# EAGLE design PANEL (EAGLE 7.5.0)
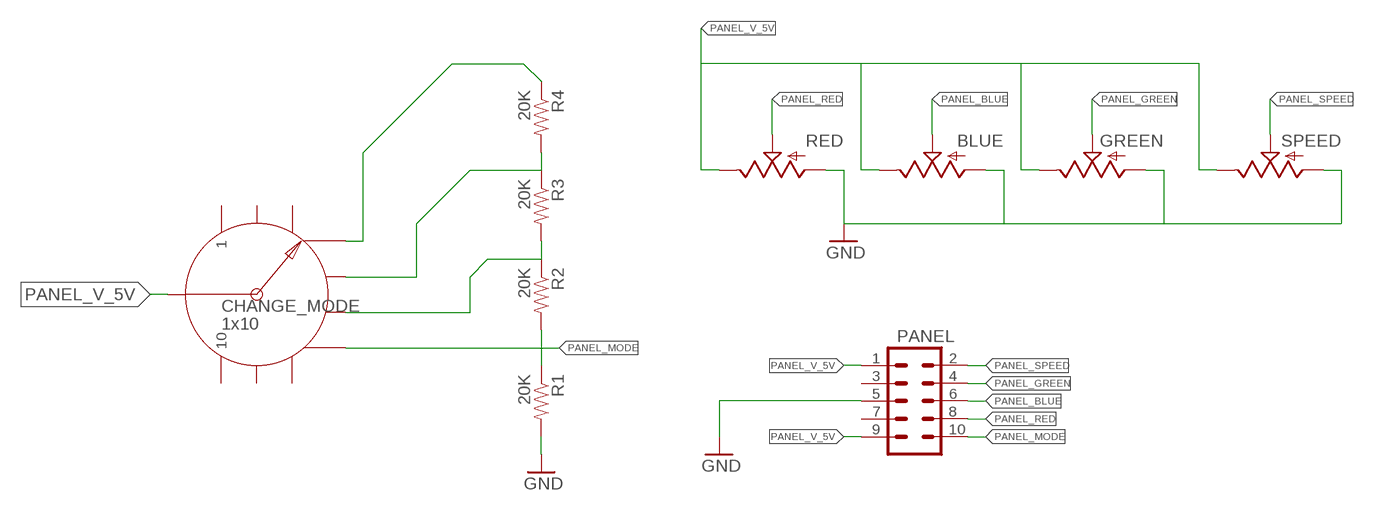
[diagram p0: schematic, sheet 1]

## Parts
BLUE  POT-RV16AF-20  [POT_ALPHA_RV16AF-20]
CHANGE_MODE  1x10  SWITCH_ROTARY_1X10  [ROTARY_SWITCH_1X10]
GREEN  POT-RV16AF-20  [POT_ALPHA_RV16AF-20]
PANEL  M05X2SHD  [2X5-SHROUDED]
R1  20K  RESISTOR1206  [1206]
R2  20K  RESISTOR1206  [1206]
R3  20K  RESISTOR1206  [1206]
R4  20K  RESISTOR1206  [1206]
RED  POT-RV16AF-20  [POT_ALPHA_RV16AF-20]
SPEED  POT-RV16AF-20  [POT_ALPHA_RV16AF-20]

## Nets
GND: BLUE.1(A) GREEN.1(A) PANEL.5 R1.2 RED.1(A) SPEED.1(A)
N$2: CHANGE_MODE.4 R4.1
N$3: CHANGE_MODE.5 R3.1 R4.2
N$4: CHANGE_MODE.6 R2.1 R3.2
PANEL_BLUE: BLUE.2(S) PANEL.6
PANEL_GREEN: GREEN.2(S) PANEL.4
PANEL_MODE: CHANGE_MODE.7 PANEL.10 R1.1 R2.2
PANEL_RED: PANEL.8 RED.2(S)
PANEL_SPEED: PANEL.2 SPEED.2(S)
PANEL_V_5V: BLUE.3(E) CHANGE_MODE.COMMON GREEN.3(E) PANEL.1 PANEL.9 RED.3(E) SPEED.3(E)
Unconnected: CHANGE_MODE.1 CHANGE_MODE.2 CHANGE_MODE.3 CHANGE_MODE.8 CHANGE_MODE.9 CHANGE_MODE.10 PANEL.3 PANEL.7

## Library data of the parts
BLUE GREEN RED SPEED = SparkFun-Electromechanical:POT
CHANGE_MODE = SparkFun-Electromechanical:SWITCH_ROTARY_1X10: SWCH-12120; PROD_ID: SWCH-12120
PANEL = SparkFun-Connectors:M05X2: Header 5x2 Standard 10-pin dual row 0.1" header. Commonly used with AVR-ISP. Use with Spark Fun Electronics SKU: PRT-00778
R1-R4 = SparkFun-Resistors:RESISTOR: Resistor Basic schematic elements and footprints for 0603, 1206, and PTH resistors.

## Net classes
0 default: width 0.254 mm

## Board
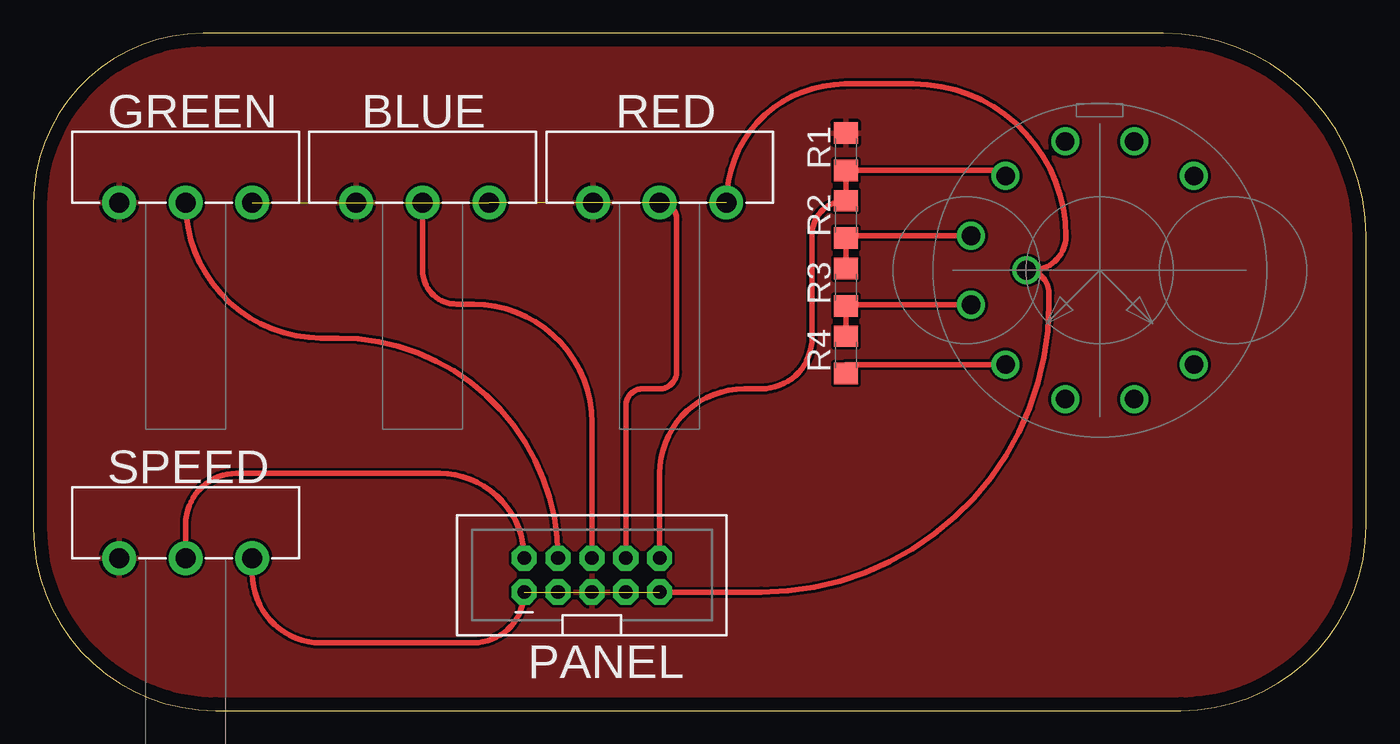
[diagram p1: board, top side]

Size 100 x 50.79 mm. Coordinates in mm from the lower left corner, seen from the top.
Outline: 0,38.03 0,13.68 arc90 13.68,0 86.09,0 arc90 100,13.9 100,35.56 arc90 84.77,50.79 12.76,50.79 arc90 0,38.03
Copper layers (1*16): Top 0.035mm / dielectric 1.5mm / Bottom 0.035mm
Design rules "default": minimum track width 10mil, minimum drill 24mil, track to track 8mil, track to pad 8mil, pad to pad 8mil, via to via 8mil, smd to smd 8mil, copper to edge 40mil, drill to drill 8mil, minimum pad ring 10mil, minimum via ring 8mil, stop-mask expansion 4mil, vias tented up to drill 0mil, thermal gap 10mil

### Footprints (pad centres in the part's own frame; a part is rotated, then mirrored left to right if it is on the bottom)
POT_ALPHA_RV16AF-20 = drill 1.5 pad 2.54: 1 -5,0; 2 0,0; 3 5,0
ROTARY_SWITCH_1X10 = drill 1.4: 1 7.071,7.071; 2 9.659,2.588; 3 9.659,-2.588; 4 7.071,-7.071; 5 2.588,-9.659; 6 -2.588,-9.659; 7 -7.071,-7.071; 8 -9.659,-2.588; 9 -9.659,2.588; 10 -7.071,7.071; COMMON 0,-5.5
2X5-SHROUDED = drill 1.016 pad 1.88 octagon: 1 -1.27,5.08; 2 1.27,5.08; 3 -1.27,2.54; 4 1.27,2.54; 5 -1.27,0; 6 1.27,0; 7 -1.27,-2.54; 8 1.27,-2.54; 9 -1.27,-5.08; 10 1.27,-5.08
1206 = smd 1.6 x 1.8: 1 -1.4,0; 2 1.4,0

### Placement (x,y rotation side)
BLUE  29.21,38.1 0 top
CHANGE_MODE  80.01,33.02 270 top
GREEN  11.43,38.1 0 top
PANEL  41.91,10.16 90 top
R1  60.96,41.91 90 top
R2  60.96,36.83 90 top
R3  60.96,31.75 90 top
R4  60.96,26.67 90 top
RED  46.99,38.1 0 top
SPEED  11.43,11.43 0 top

### Tracks (layer width: path | path; a pad name or v marks a point on that pad's centre or on a via)
GND
  pour Top: -10.16,86.36 -10.16,-8.89 107.95,-8.89 107.95,86.36
N$2
  Top 0.406: CHANGE_MODE.4 60.96,25.95 R4.1
N$3
  Top 0.406: R4.2 R3.1 60.96,30.43 CHANGE_MODE.5
N$4
  Top 0.406: R3.2 R2.1 60.96,35.61 CHANGE_MODE.6
PANEL_BLUE
  Top 0.406: PANEL.6 41.91,21.59 arc90 33.02,30.48 31.75,30.48 arc-90 29.21,33.02 BLUE.2
PANEL_GREEN
  Top 0.406: PANEL.4 arc90 22.86,27.94 21.59,27.94 arc-90 GREEN.2
PANEL_MODE
  Top 0.406: CHANGE_MODE.7 72.94,40.51 R1.1 R2.2 arc90 58.42,35.69 58.42,27.94 arc-90 54.61,24.13 53.34,24.13 arc90 46.99,17.78 PANEL.10
PANEL_RED
  Top 0.406: PANEL.8 44.45,22.86 arc-90 45.72,24.13 46.99,24.13 arc90 48.26,25.4 48.26,36.83 arc90 RED.2
PANEL_SPEED
  Top 0.406: SPEED.2 11.43,13.97 arc-90 15.24,17.78 30.48,17.78 arc-90 PANEL.2
PANEL_V_5V  (3 unrouted)
  Top 0.406: SPEED.3 16.43,10.24 arc90 21.59,5.08 33.02,5.08 arc90 PANEL.1 | PANEL.9 54.61,8.89 arc90 76.2,30.48 76.2,31.33 arc90 CHANGE_MODE.COMMON 74.93,33.02 arc90 77.47,35.56 arc90 66.04,46.99 60.88,46.99 arc90 RED.3